# Altium schematic sheet SN65HVD230DR1_SN65HVD230DR.schdoc
size 127 x 99 mm
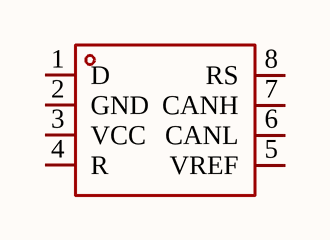
[diagram p0: SN65HVD230DR1_SN65HVD230DR.schdoc]

## Parts
U?  SN65HVD230DR  [SOIC-8_L4.9-W3.9-P1.27-LS6.0-BL]  (value not drawn)

## Nets

Not connected (* = marked no-connect by the designer): U? 1(D) 2(GND) 3(VCC) 4(R) 5(VREF) 6(CANL) 7(CANH) 8(RS)

## Library data of the parts
U? = SN65HVD230DR: Manufacturer: TI(德州仪器); Add into BOM: yes; Data Rate: 1Mbps; Supply Voltage: 3V~3.6V; Symbol: SN65HVD230DR; Device: SN65HVD230DR; LCSC Part Name: 1Mbps 3V~3.6V; Supplier Part: C12084; Manufacturer Part: SN65HVD230DR; Supplier Footprint: SOIC-8; JLCPCB Part Class: Extended Part; Datasheet: https://www.ti.com/cn/lit/gpn/sn65hvd230; Supplier: LCSC; Convert to PCB: yes; Type: 收发器; Operating Temperature: -40℃~+85℃